# Altium schematic sheet HIVE_BOARD_TITLE.SchDoc
size Tabloid; DocumentNumber: 1; SheetNumber: 1; SheetTotal: 3; Sheet_Name: Insert name in Document Parameters; Size: 11x17
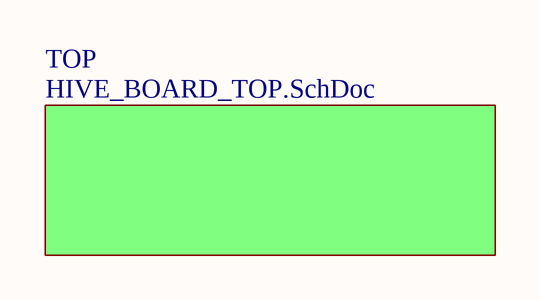
[diagram p0: HIVE_BOARD_TITLE.SchDoc]

## Sub-sheets
TOP = HIVE_BOARD_TOP.SchDoc: no entries

## Notes on the sheet
- Revision history
- Package size conversion
- Metric
- 1005
- 1608
- Imperial
- 0402
- 0603
- Revision
- 2012
- 3216
- 0805
- 1206
- 3225
- 6432
- 1210
- 2512
- Date :
- Project Title
- Global Project
- Size
- Date
- Group
- Sheet
- of
- Filename
- Designers